# EAGLE schematic SACS PCB Connection Schematic (EAGLE 9.7.0)
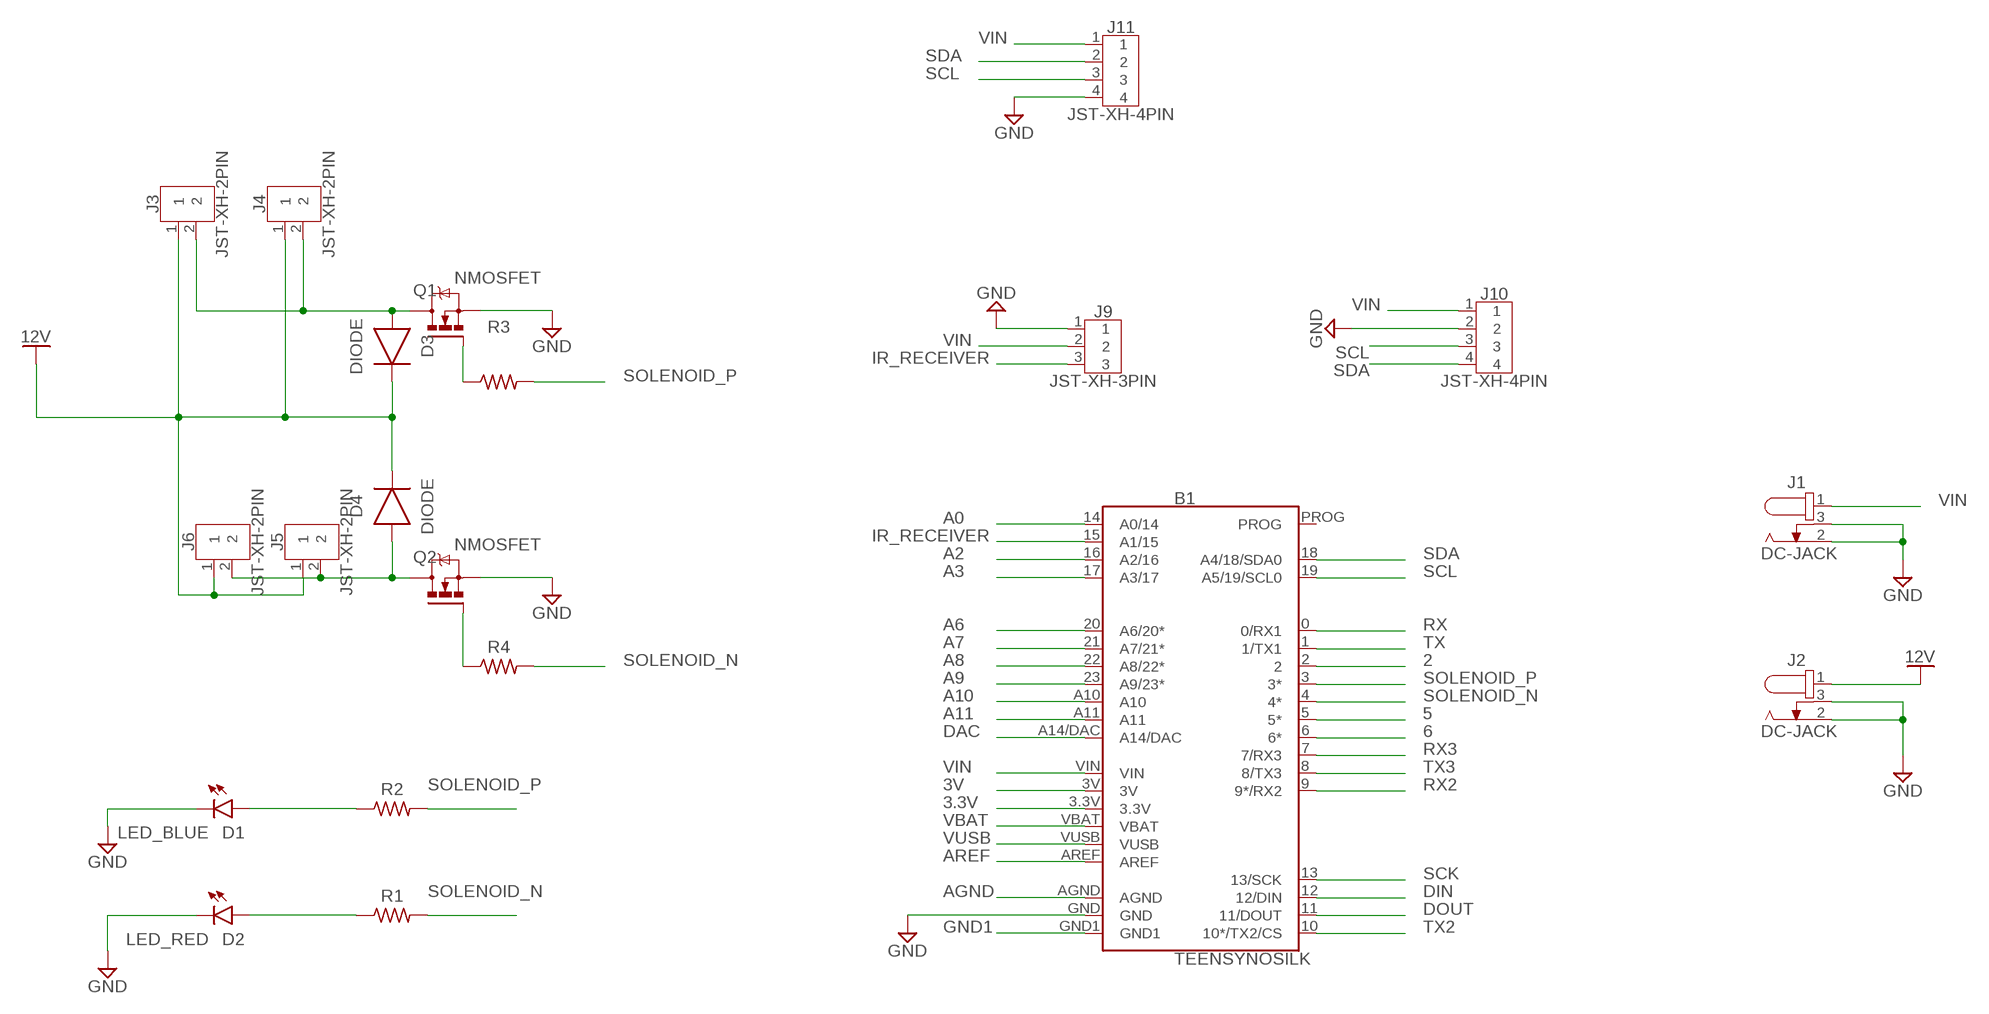
[diagram p0: schematic, sheet 1]

## Parts
B1  TEENSYNOSILK  [TEENSY_NOSILK]
D1  LED_BLUE  CHIP-ROUND-B_1209  [LEDC3224X250N_RND-B]
D2  LED_RED  CHIP-ROUND-R_1209  [LEDC3224X250N_RND-R]
D3  DIODE  DIODE_DO-213AA(SOD-80)  [DIOMELF3516]
D4  DIODE  DIODE_DO-213AA(SOD-80)  [DIOMELF3516]
J1  DC-JACK  694106402002  [694106402002]
J2  DC-JACK  694106402002  [694106402002]
J3  JST-XH-2PIN  B2B-XH-A  [B2B-XH-A]
J4  JST-XH-2PIN  B2B-XH-A  [B2B-XH-A]
J5  JST-XH-2PIN  B2B-XH-A  [B2B-XH-A]
J6  JST-XH-2PIN  B2B-XH-A  [B2B-XH-A]
J9  JST-XH-3PIN  B3B-XH-A  [B3B-XH-A]
J10  JST-XH-4PIN  B4B-XH-A  [B4B-XH-A]
J11  JST-XH-4PIN  B4B-XH-A  [B4B-XH-A]
Q1  NMOSFET  NMOSFET_TO220  [TO220BV]
Q2  NMOSFET  NMOSFET_TO220  [TO220BV]
R1  R-US_AXIAL-7.2MM-PITCH  [RESAD724W46L381D178B]
R2  R-US_AXIAL-7.2MM-PITCH  [RESAD724W46L381D178B]
R3  R-US_AXIAL-7.2MM-PITCH  [RESAD724W46L381D178B]
R4  R-US_AXIAL-7.2MM-PITCH  [RESAD724W46L381D178B]

## Nets
2: B1.2
3.3V: B1.3.3V
3V: B1.3V
5: B1.5(5*)
6: B1.6(6*)
12V: D3.1(C) D4.1(C) J2.1 J3.1 J4.1 J5.1 J6.1
A0: B1.14(A0/14)
A2: B1.16(A2/16)
A3: B1.17(A3/17)
A6: B1.20(A6/20*)
A7: B1.21(A7/21*)
A8: B1.22(A8/22*)
A9: B1.23(A9/23*)
A10: B1.A10
A11: B1.A11
AGND: B1.AGND
AREF: B1.AREF
DAC: B1.A14/DAC
DIN: B1.12(12/DIN)
DOUT: B1.11(11/DOUT)
GND: B1.GND D1.C D2.C J1.2 J1.3 J2.2 J2.3 J9.1 J10.2 J11.4 Q1.S Q2.S
GND1: B1.GND1
IR_RECEIVER: B1.15(A1/15) J9.3
N$1: D1.A R2.1
N$2: D2.A R1.1
N$3: Q2.G R4.1
N$4: Q1.G R3.1
N$5: D3.2(A) J3.2 J4.2 Q1.D
N$6: D4.2(A) J5.2 J6.2 Q2.D
RX: B1.0(0/RX1)
RX2: B1.9(9*/RX2)
RX3: B1.7(7/RX3)
SCK: B1.13(13/SCK)
SCL: B1.19(A5/19/SCL0) J10.3 J11.3
SDA: B1.18(A4/18/SDA0) J10.4 J11.2
SOLENOID_N: B1.4(4*) R1.2 R4.2
SOLENOID_P: B1.3(3*) R2.2 R3.2
TX: B1.1(1/TX1)
TX2: B1.10(10*/TX2/CS)
TX3: B1.8(8/TX3)
VBAT: B1.VBAT
VIN: B1.VIN J1.1 J9.2 J10.1 J11.1
VUSB: B1.VUSB
Unconnected: B1.PROG

## Library data of the parts
B1 = SparkFun-Boards:TEENSY: Teensy Footprint Mechanical footprint with connectors for Teensy Development Board with ARM Cortex. SparkFun Products: Teensy 4.0 <https://www.sparkfun.com/products/15583> Teensy 4.0 (with Headers) <https://www.sparkfun.com/products/16997> Teensy 3.2 <https://www.sparkfun.com/products/13736> Teensy LC <https://www.sparkfun.com/products/13305> SparkFun Qwiic Shield for Teensy <https://www.sparkfun.com/products/17119> Teensy Header Kit <https://www.sparkfun.com/products/13925>; SF_ID: DEV-12646
D1 = LED:CHIP-ROUND-B; CATEGORY: LED; COLOR: BLUE; DESCRIPTION: CHIP LED ROUND; SUB-CATEGORY: CHIP; TYPE: ROUND_TOP
D2 = LED:CHIP-ROUND-R: LED - Generic; CATEGORY: LED; COLOR: RED; DESCRIPTION: CHIP LED ROUND; SUB-CATEGORY: CHIP; TYPE: ROUND_TOP
D3 D4 = Diode:DIODE: Diode Rectifier - Generic; CATEGORY: Diode; SUB-CATEGORY: Rectifier
J1 J2 = Connector:694106402002: DC POWER JACK - VERTICAL - THT - 2.0 & 2.5Ø - WR-DC Details see: Datasheet <https://katalog.we-online.com/en/em/DC_THT_VERTICAL_6_4_69410X402002>; CATEGORY: DC Power Connectors; DESCRIPTION: DC POWER JACK - VERTICAL - THT - 2.0 & 2.5Ø - WR-DC; MANUFACTURER: Würth Elektronik; MPN: 694106402002; OPERATING_TEMPERATURE: -40°C to +85°C; PART_STATUS: Active; PITCH: value; ROHS_COMPLIANCE: RoHS3 Compliant; SERIES: WR-DC; SUBCATEGORY: Power Connectors; TYPE: Jack Male, Through Hole
J3-J6 = Connector:B2B-XH-A: XH Connector Top Entry - 2POS Details see: Datasheet <http://www.jst-mfg.com/product/pdf/eng/eXH.pdf>; CATEGORY: Header; DESCRIPTION: Connector Header Through Hole 2 position 0.098" (2.50mm); MANUFACTURER: JST Sales America Inc.; MPN: B2B-XH-A(LF)(SN); OPERATING_TEMPERATURE: -25°C ~ 85°C; PART_STATUS: ACTIVE; PITCH: 0.098" (2.50mm); ROHS_COMPLIANCE: ROHS3 Compliant; SERIES: XH; SUB_CATEGORY: Rectangular Connectors; TYPE: Header, Male Pin, Board to Cable/Wire, Through Hole
J9 = Connector:B3B-XH-A: XH Connector Top Entry - 3POS Details see: Datasheet <http://www.jst-mfg.com/product/pdf/eng/eXH.pdf>; CATEGORY: Header; DESCRIPTION: Connector Header Through Hole 3 position 0.098" (2.50mm); MANUFACTURER: JST Sales America Inc.; MPN: B3B-XH-A(LF)(SN); PART_STATUS: ACTIVE; PITCH: 0.098" (2.50mm); ROHS_COMPLIANCE: ROHS3 Compliant; SERIES: XH; SUB_CATEGORY: Rectangular Connectors; TYPE: Header, Male Pin, Board to Cable/Wire, Through Hole
J10 J11 = Connector:B4B-XH-A: XH Connector Top Entry - 4POS Details see: Datasheet <http://www.jst-mfg.com/product/pdf/eng/eXH.pdf>; CATEGORY: Header; DSECRIPTION: Connector Header Through Hole 4 position 0.098" (2.50mm); MANUFACTURER: JST Sales America Inc.; MPN: B4B-XH-A(LF)(SN); OPERATING_TEMPERATURE: -25 C to 85 C; PART_STATUS: ACTIVE; PITCH: 0.098" (2.50mm); ROHS_COMPLIANCE: ROHS3 Compliant; SERIES: XH; SUB_CATEGORY: Rectangular Connectors; TYPE: Header, Male Pin, Board to Cable/Wire, Through Hole
Q1 Q2 = Transistor:NMOSFET: N-Channel MOSFET - Generic; CATEGORY: Transistor; SUB-CATEGORY: MOSFET; TYPE: N-Channel
R1-R4 = Resistor:R-US: Resistor Fixed - ANSI; CATEGORY: Resistor; SUB-CATEGORY: Fixed